# EasyEDA Pro project SchadenDeck.eprj, schematic MainBoard

## Sheets
1 Power, USB, & MCU: Board Name: MainBoard; Create Date: 2026-01-08; Page Name: Power, USB, & MCU; Project Name: SchadenDeck; Schematic Name: MainBoard; Update Date: 2026-02-11; Company: EasyEDA.com; Page Size: A4; Version: V1.0
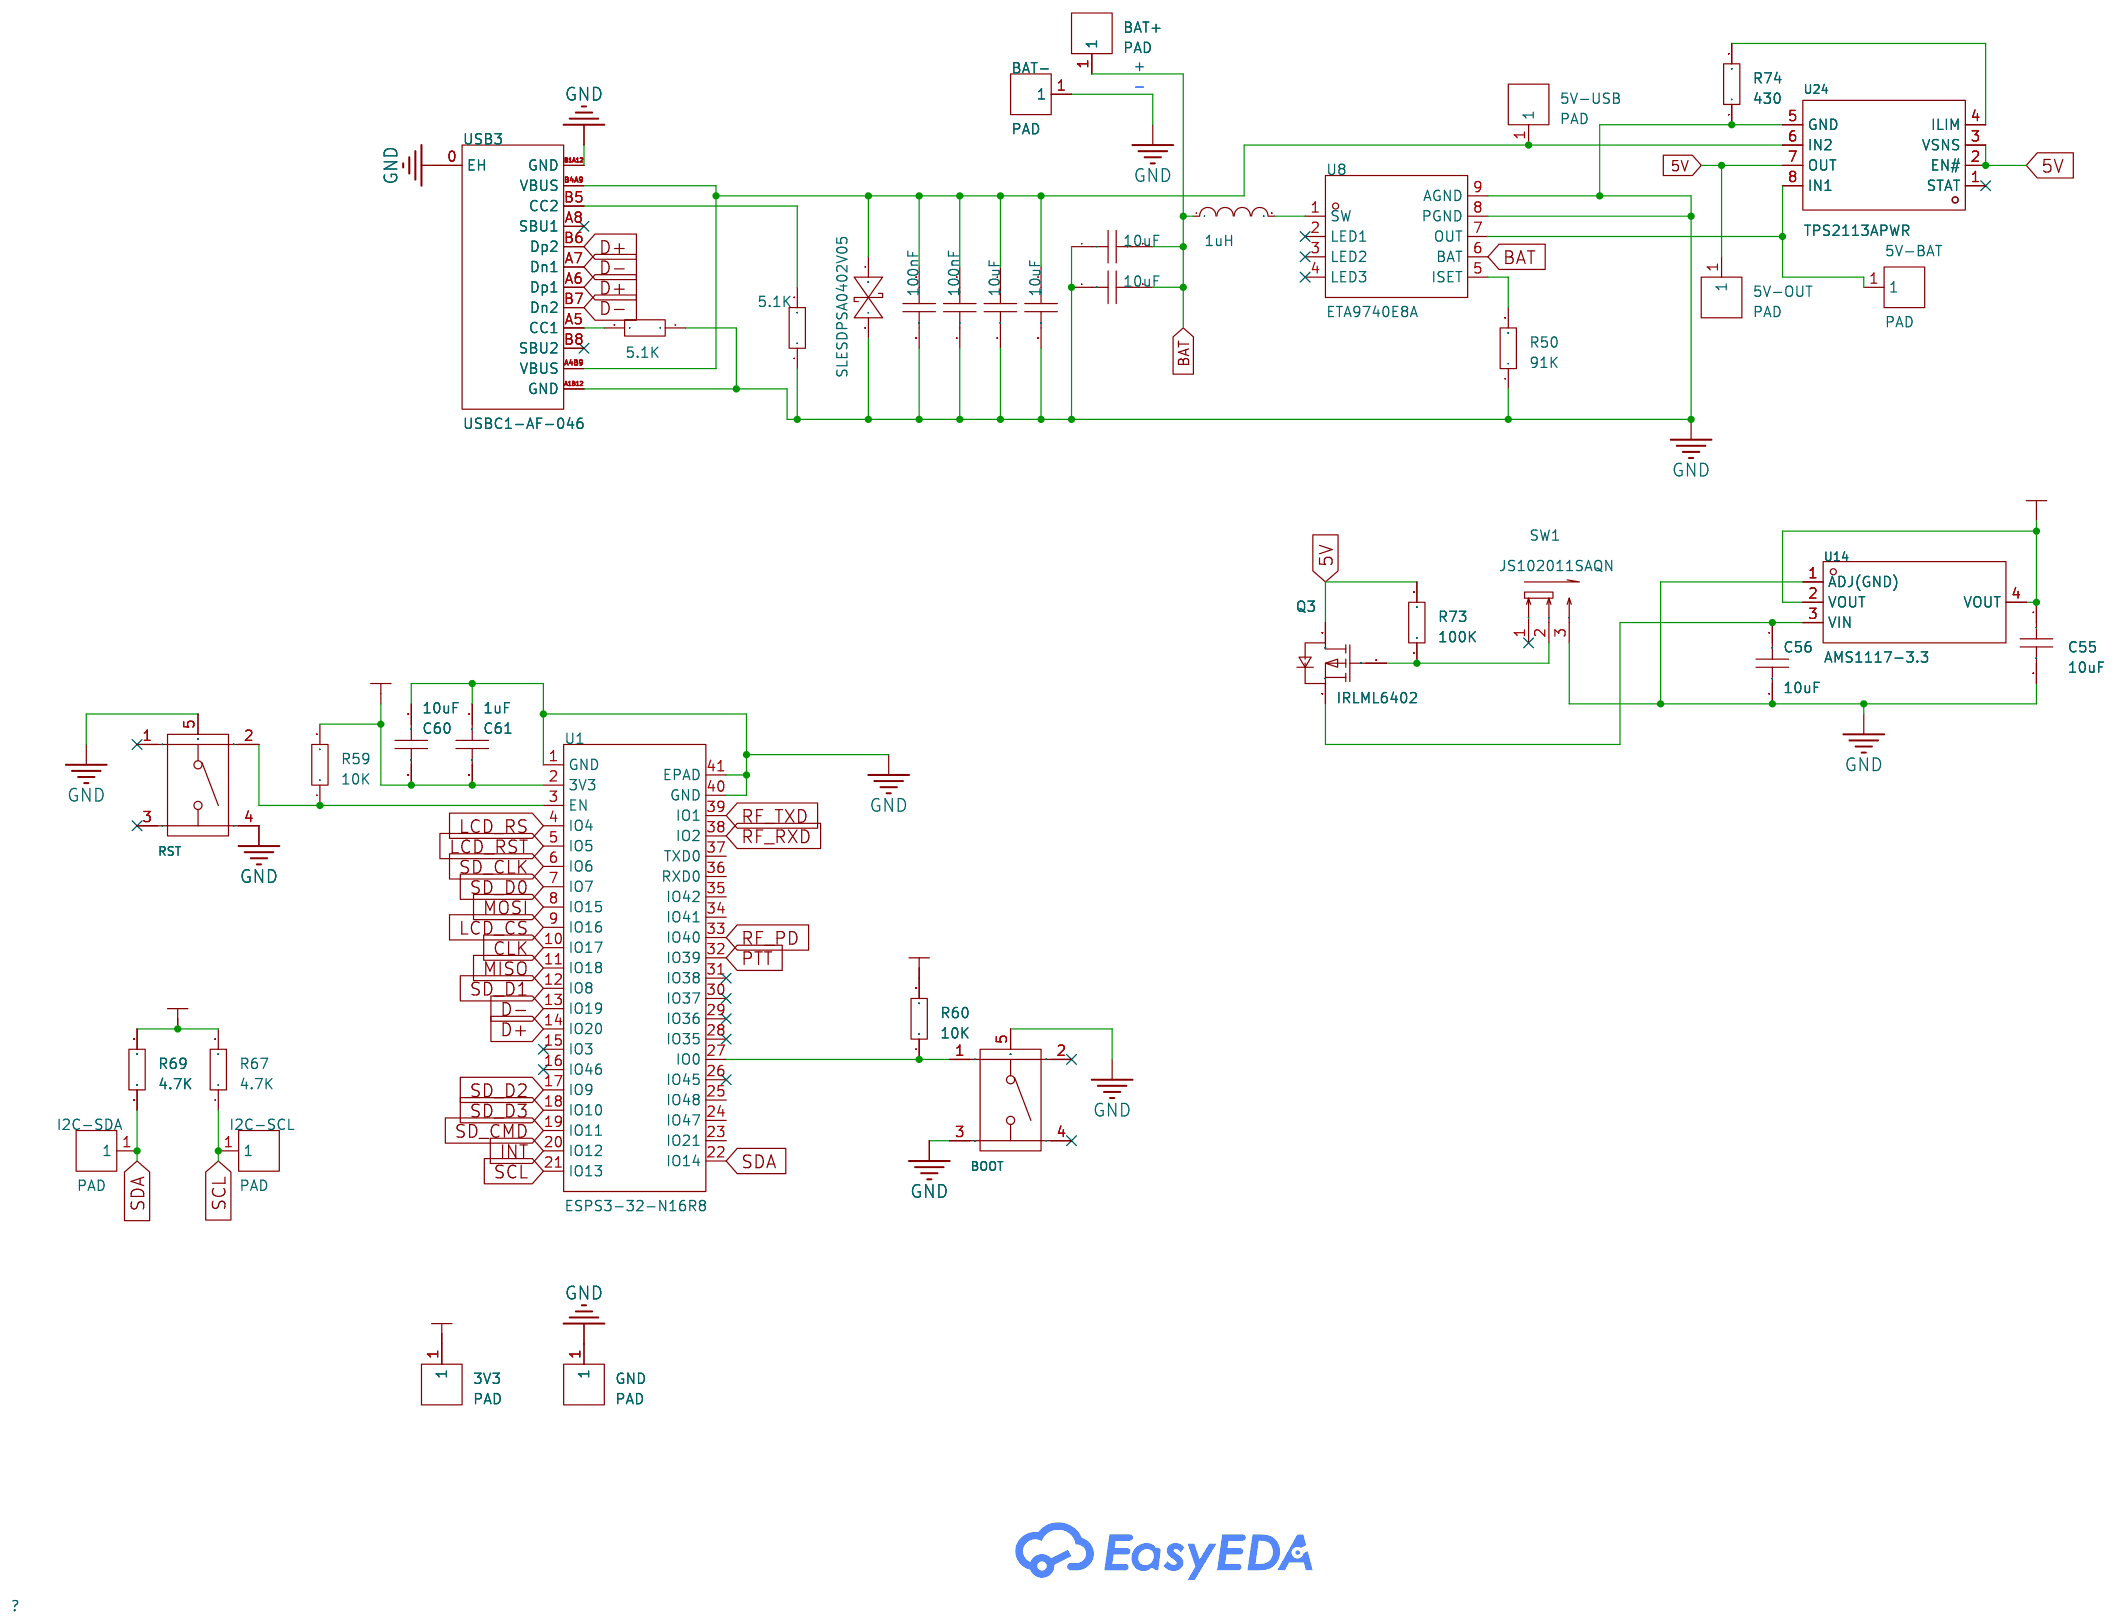
[diagram p0: Power, USB, & MCU]
2 Keyboard: Page Name: Keyboard; Update Date: 2026-01-18
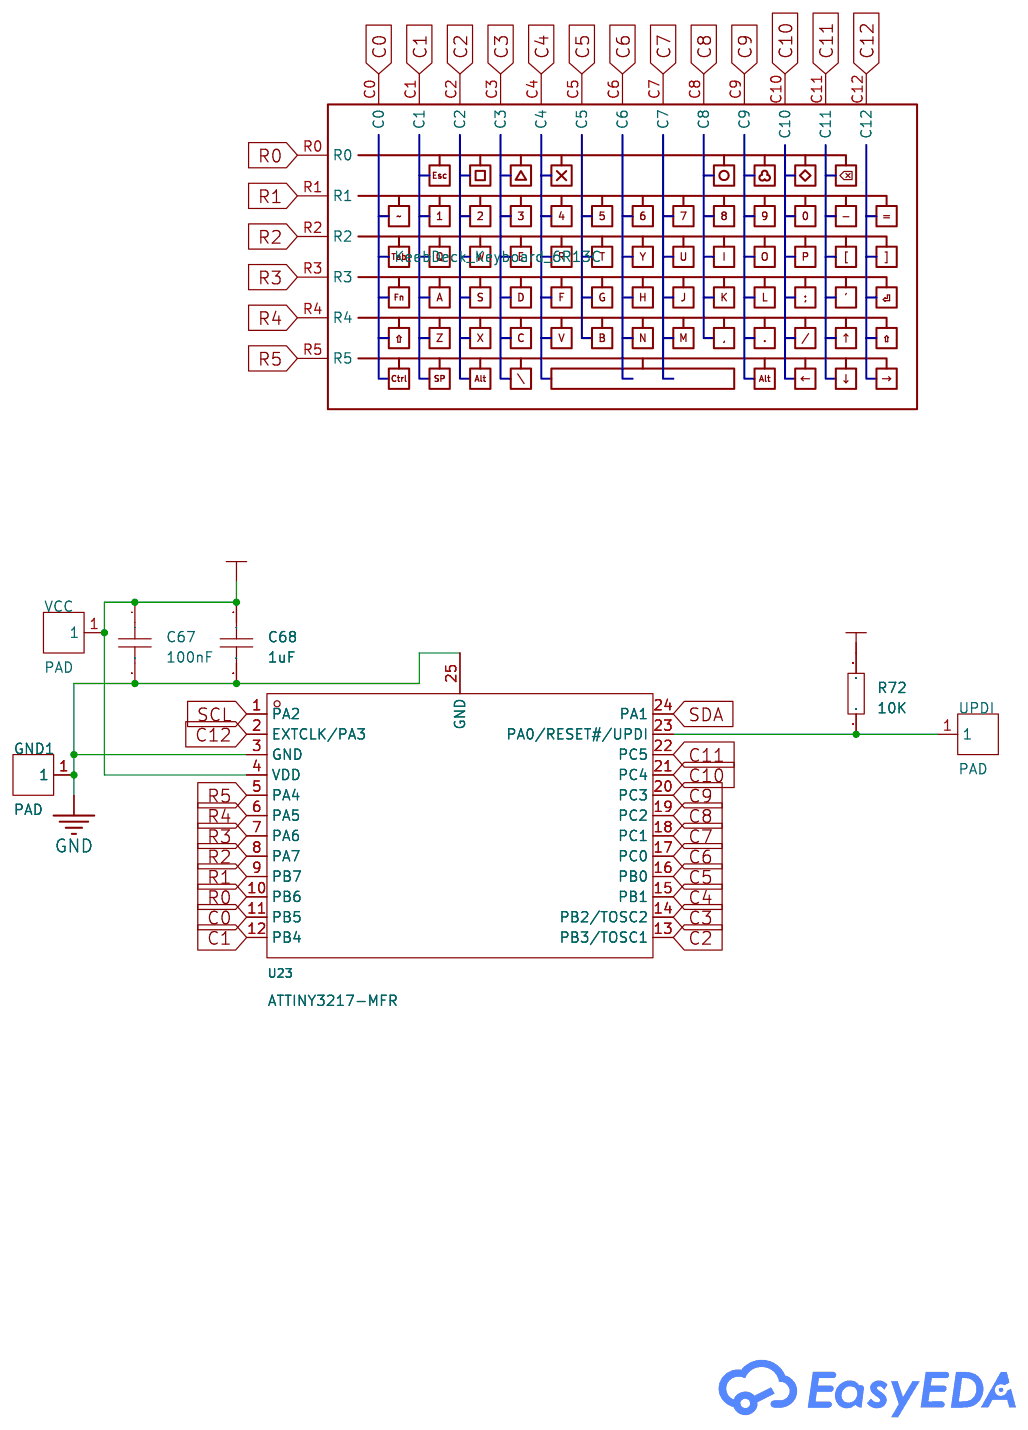
[diagram p1: Keyboard]
3 Storage & LCD: Page Name: Storage & LCD; Update Date: 2026-01-11
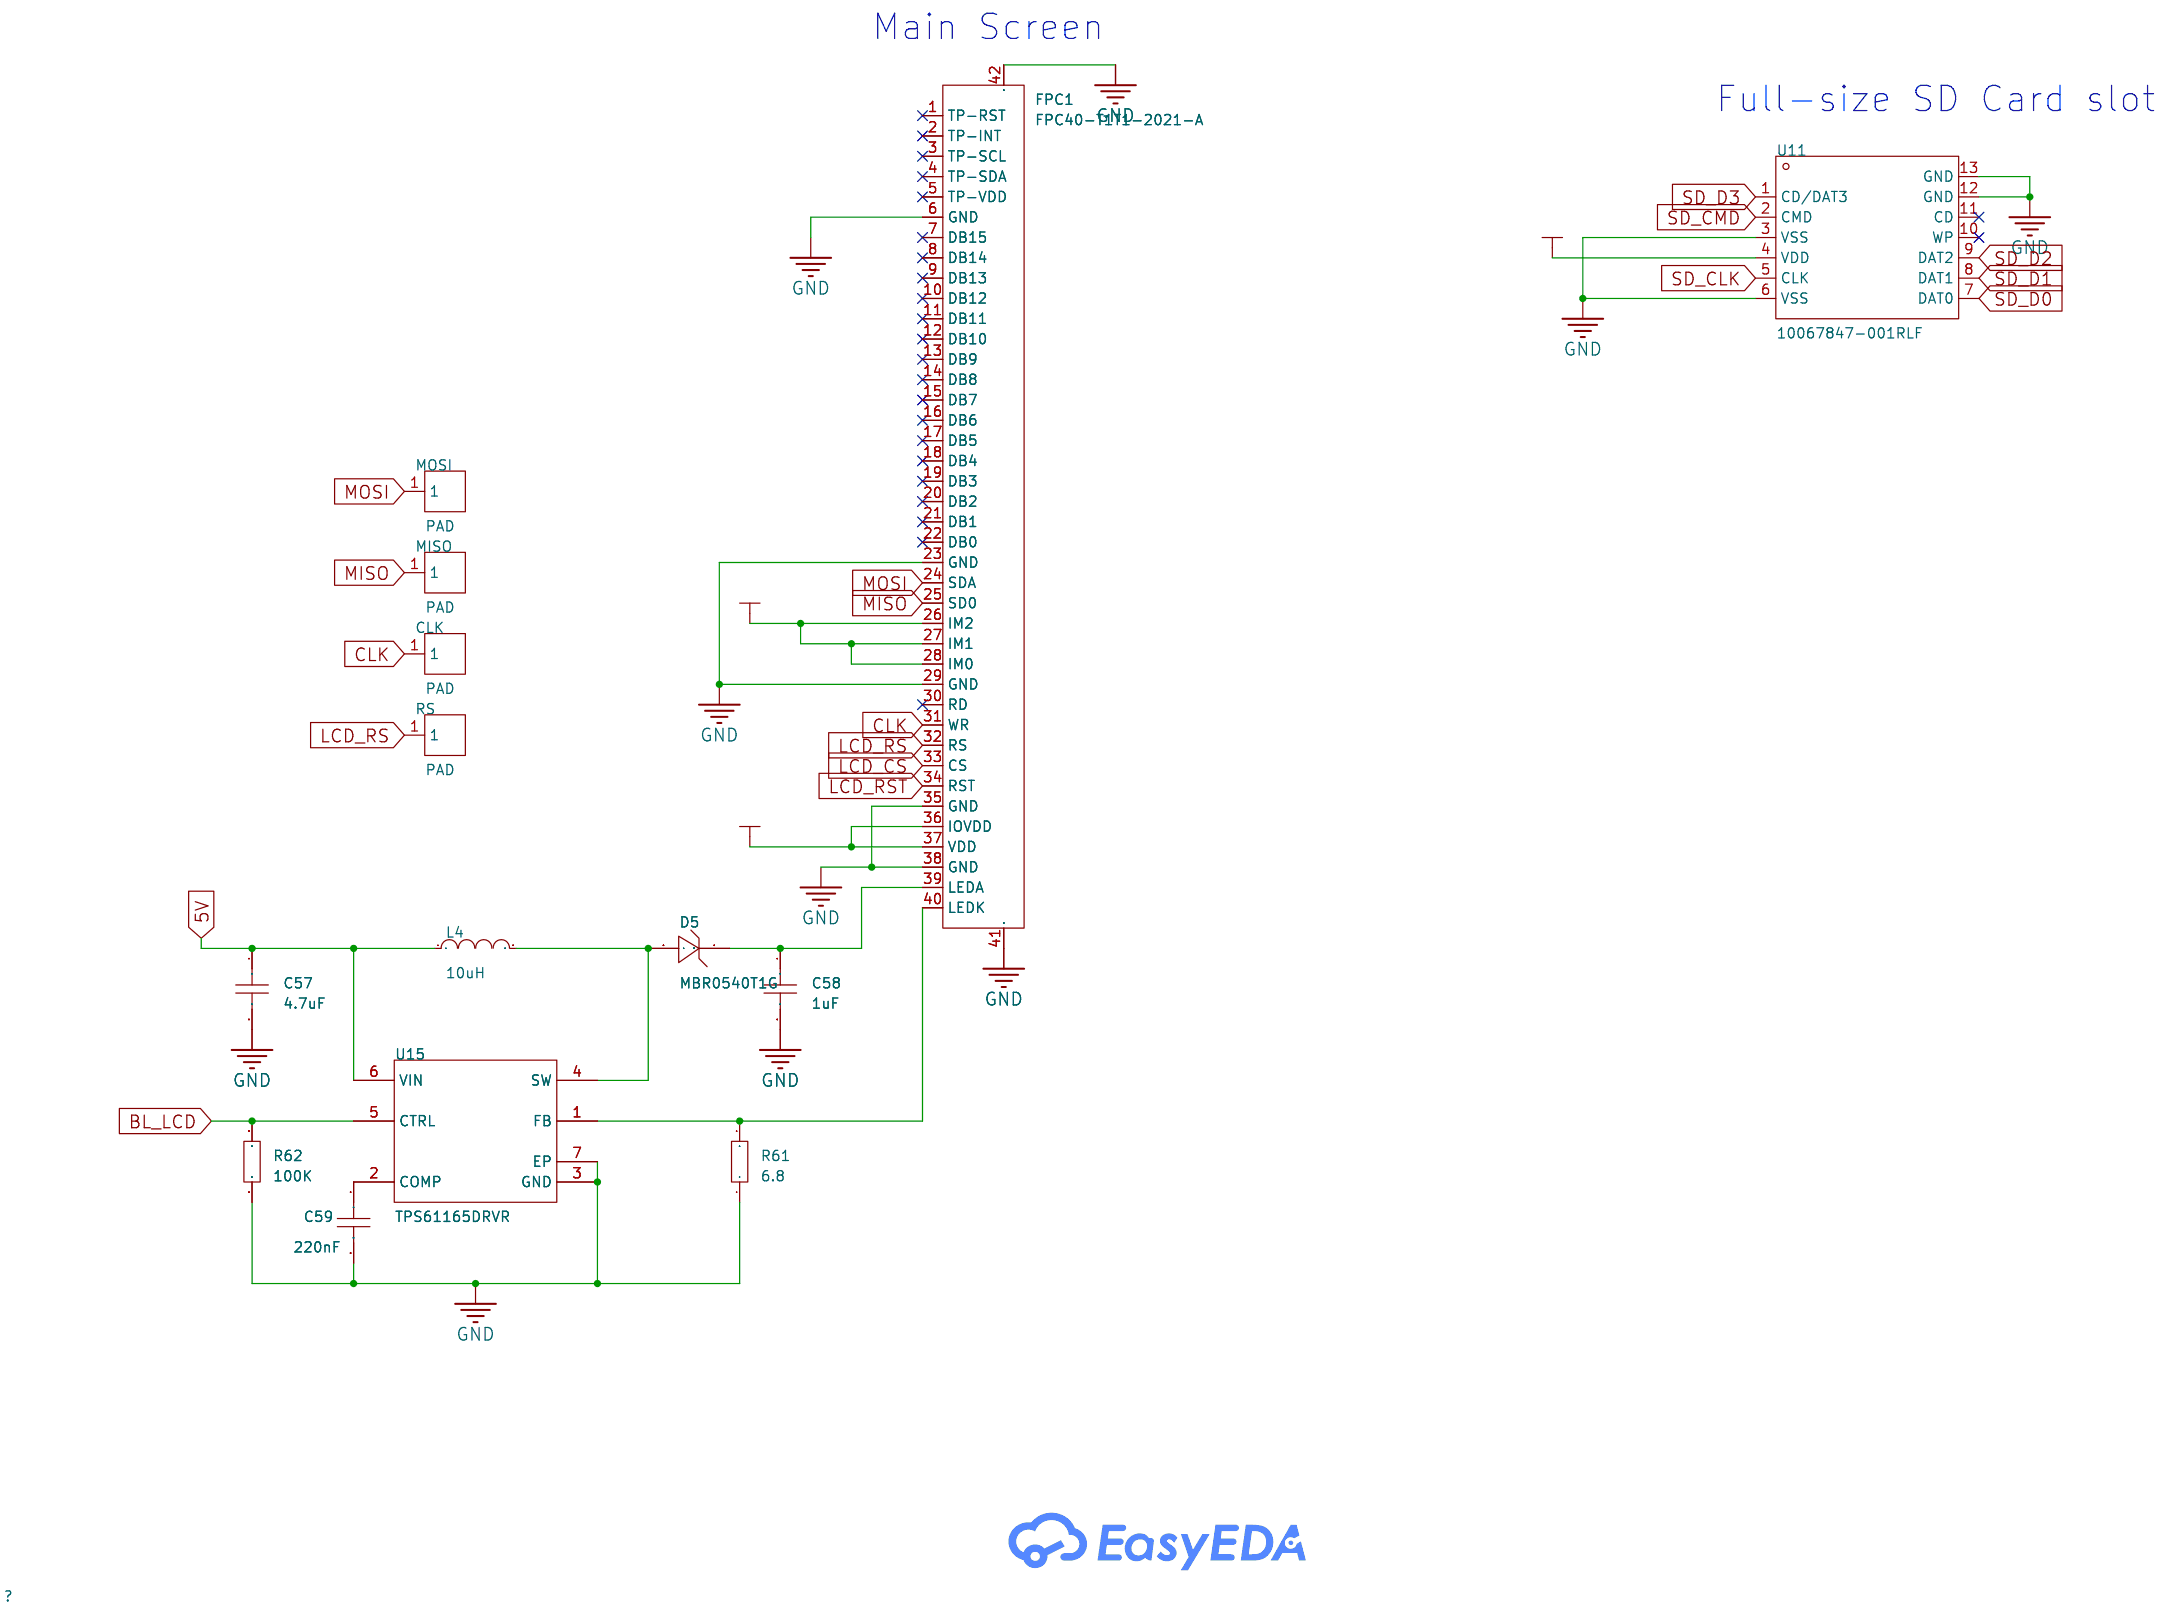
[diagram p2: Storage & LCD]
4 Audio & RF: Page Name: Audio & RF; Update Date: 2026-01-18
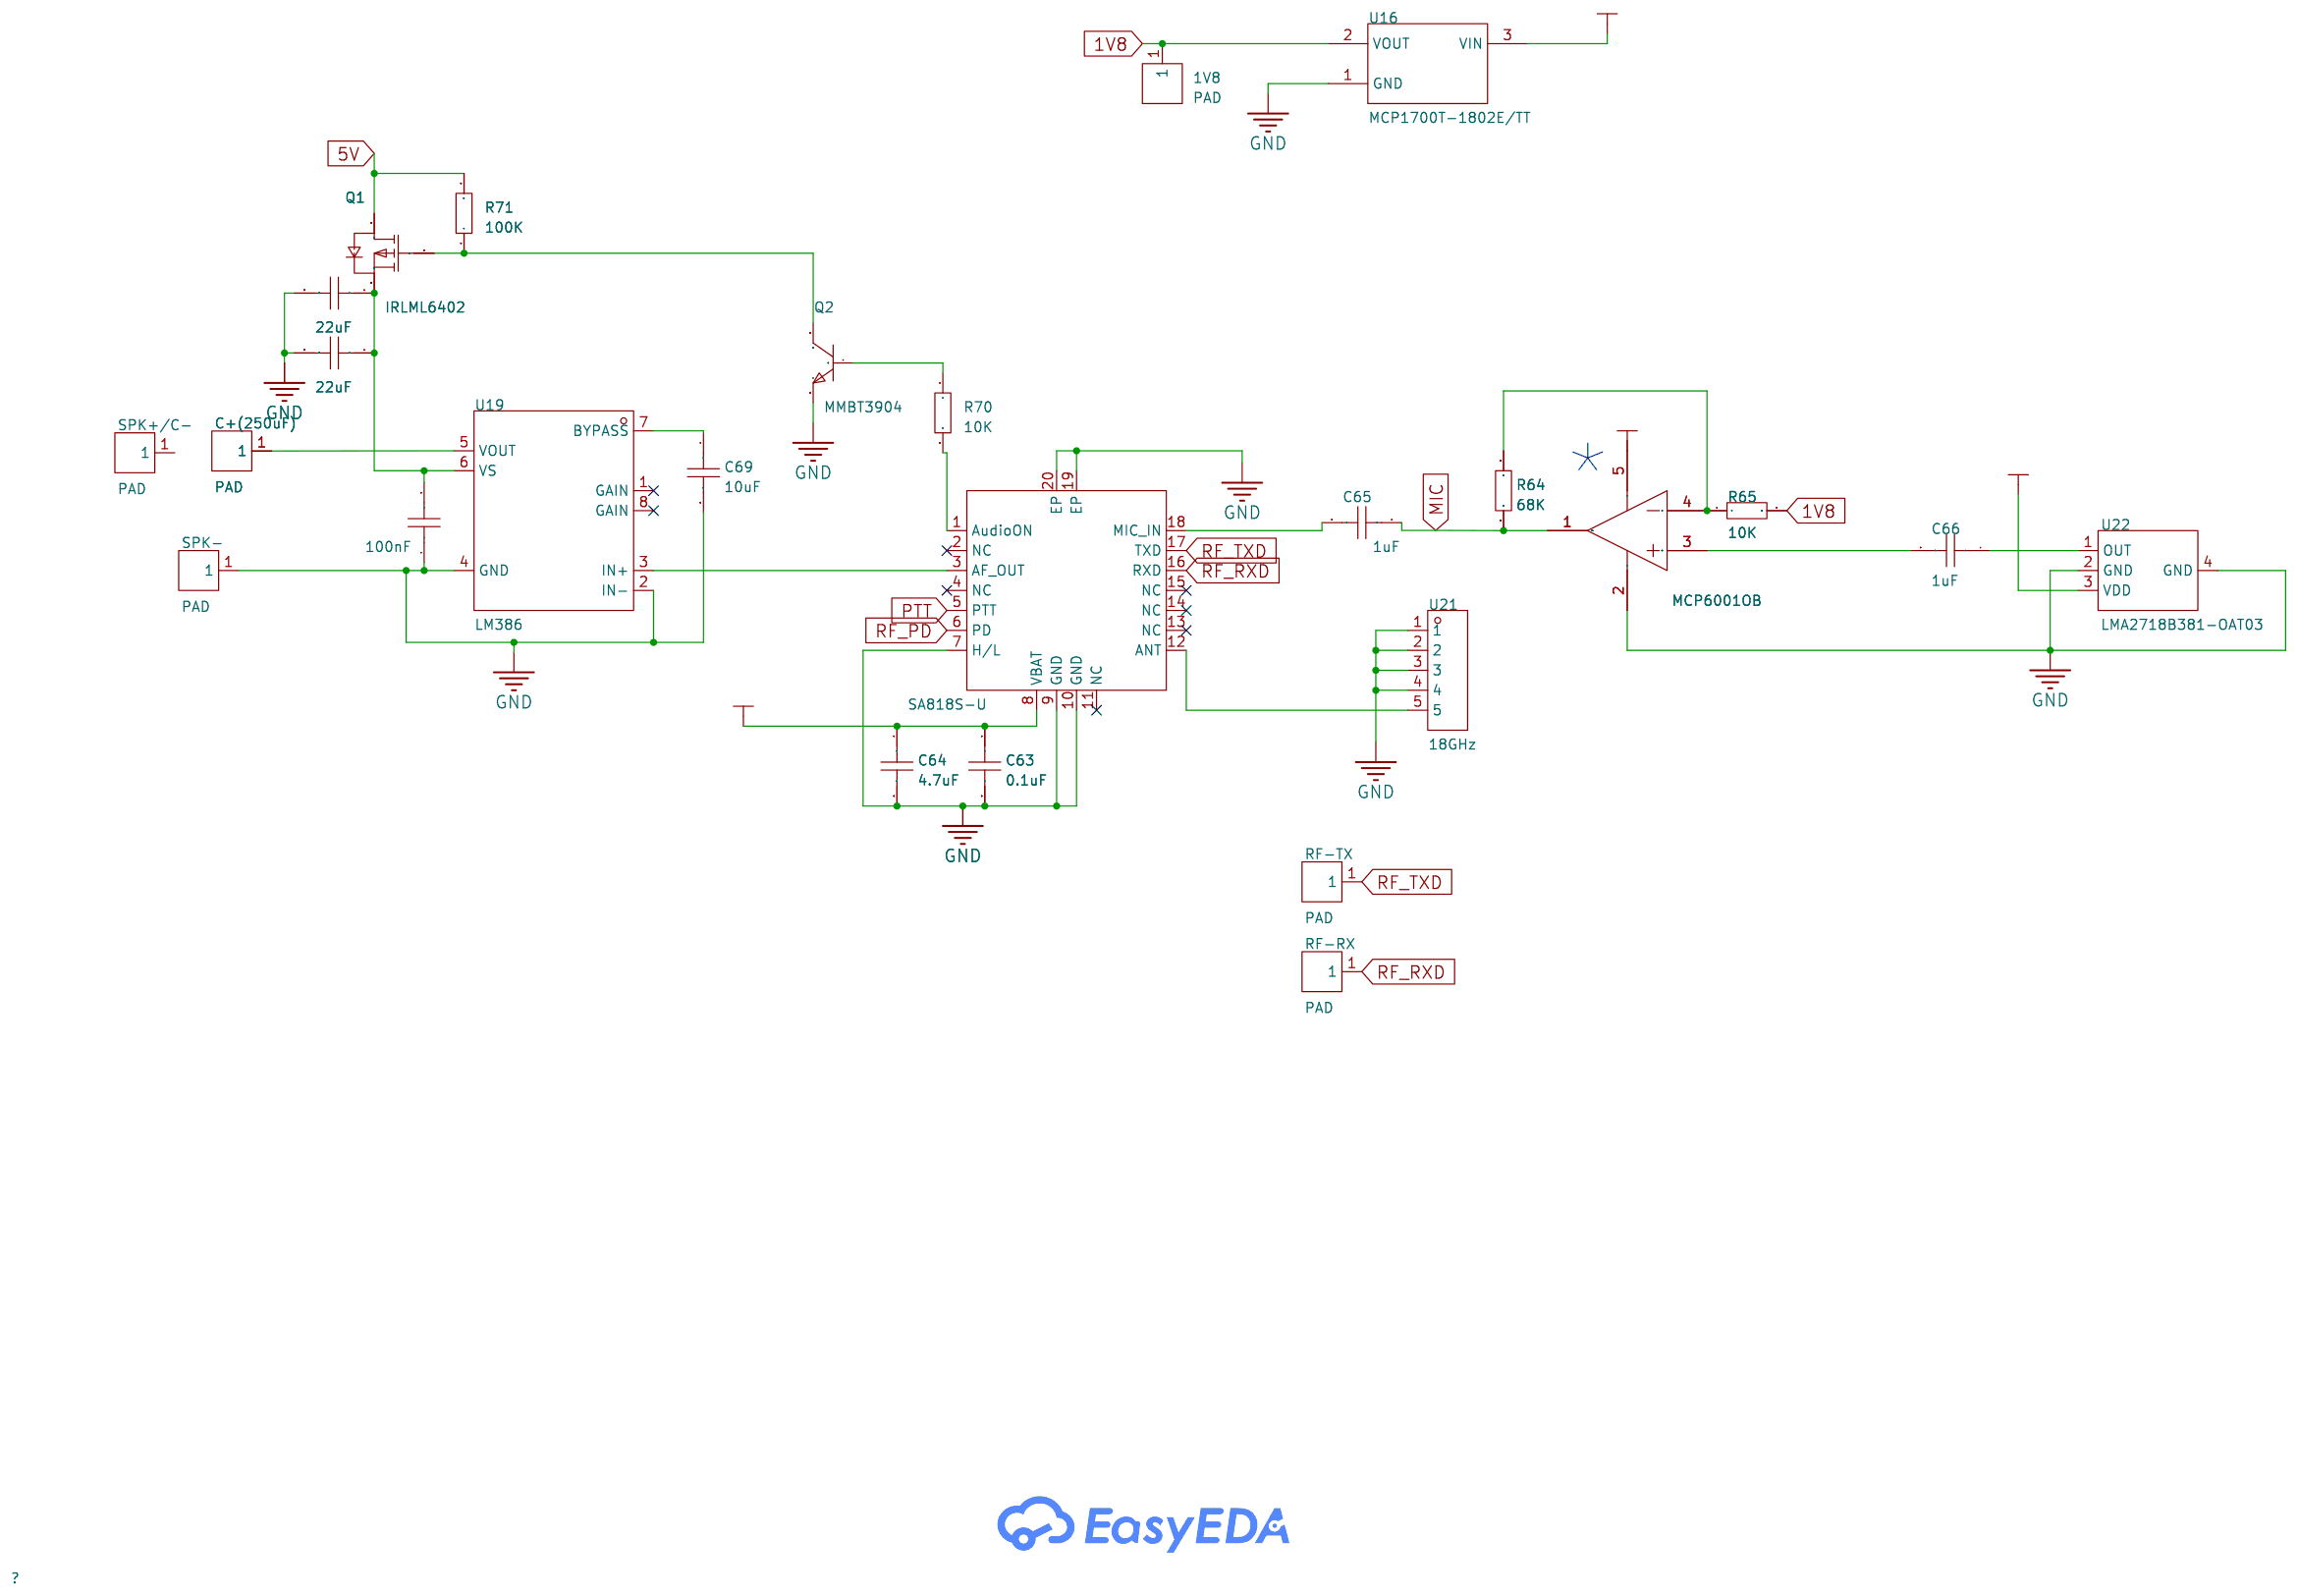
[diagram p3: Audio & RF]

## Parts
sheet Audio & RF
1V8  PAD  [SMD_BD4.0-L4.0-W4.0-D1.0]  (no BOM)
C63  0.1uF  [C0603]
C64  4.7uF  [C0603]
C65  1uF  [C0603]
C66  1uF  [C0603]
C69  10uF  [C0603]
C70  100nF  [C0603]
C71  22uF  [C0603]
C72  22uF  [C0603]
C+(250uF)  PAD  [SMD_BD4.0-L4.0-W4.0-D1.0]  (no BOM)
Q1  IRLML6402  [SOT-23-3_L2.9-W1.3-P0.95-LS2.4-BR]
Q2  MMBT3904  [SOT-23-3_L2.9-W1.3-P1.90-LS2.4-BR]
R64  68K  [R0603]
R65  10K  [R0603]
R70  10K  [R0603]
R71  100K  [R0603]
RF-RX  PAD  [SMD_BD4.0-L4.0-W4.0-D1.0]  (no BOM)
RF-TX  PAD  [SMD_BD4.0-L4.0-W4.0-D1.0]  (no BOM)
SPK+/C-  PAD  [SMD_BD4.0-L4.0-W4.0-D1.0]  (no BOM)
SPK-  PAD  [SMD_BD4.0-L4.0-W4.0-D1.0]  (no BOM)
U16  MCP1700T-1802E/TT  [SOT-23-3_L2.9-W1.3-P1.90-LS2.4-BR]
U17  MCP6001OB  [SOT-23-5_L3.0-W1.7-P0.95-LS2.8-BR]
U18  SA818S-U  [WIRELM-SMD_G-NICERF_SA818S-X]
U19  LM386  [SOP-8_L4.9-W3.9-P1.27-LS6.0-BL]
U21  18GHz  [CONN-TH_5P-L6.1-W6.1-P5.08-TL]
U22  LMA2718B381-OAT03  [MIC-SMD_4P-L2.8-W1.9_LMA2718B381-OA7]
sheet Keyboard
C67  100nF  [C0603]
C68  1uF  [C0603]
GND1  PAD  [SMD_BD4.0-L4.0-W4.0-D1.0]  (no BOM)
R72  10K  [R0603]
U2  KeebDeck_Keyboard_6R13C  [KeebDeck_Keyboard_6R13C]
U23  ATTINY3217-MFR  [WQFN-24_L4.0-W4.0-P0.50-TL-EP2.6]
UPDI  PAD  [SMD_BD4.0-L4.0-W4.0-D1.0]  (no BOM)
VCC  PAD  [SMD_BD4.0-L4.0-W4.0-D1.0]  (no BOM)
sheet Power, USB, & MCU
3V3  PAD  [SMD_BD4.0-L4.0-W4.0-D1.0]  (no BOM)
5V-BAT  PAD  [SMD_BD4.0-L4.0-W4.0-D1.0]  (no BOM)
5V-OUT  PAD  [SMD_BD4.0-L4.0-W4.0-D1.0]  (no BOM)
5V-USB  PAD  [SMD_BD4.0-L4.0-W4.0-D1.0]  (no BOM)
BAT+  PAD  [SMD_BD4.0-L4.0-W4.0-D1.0]  (no BOM)
BAT-  PAD  [SMD_BD4.0-L4.0-W4.0-D1.0]  (no BOM)
BOOT  KMR221GLFS  [KEY-SMD_KMR2XXGXXX]
C46  100nF  [C0603]
C47  100nF  [C0603]
C48  10uF  [C0603]
C49  10uF  [C0603]
C50  10uF  [C0603]
C51  10uF  [C0603]
C55  10uF  [C0603]
C56  10uF  [C0603]
C60  10uF  [C0603]
C61  1uF  [C0603]
D2  SLESDPSA0402V05  [D0402-BI]
GND  PAD  [SMD_BD4.0-L4.0-W4.0-D1.0]  (no BOM)
I2C-SCL  PAD  [SMD_BD4.0-L4.0-W4.0-D1.0]  (no BOM)
I2C-SDA  PAD  [SMD_BD4.0-L4.0-W4.0-D1.0]  (no BOM)
L3  1uH  [L0603]
Q3  IRLML6402  [SOT-23-3_L2.9-W1.3-P0.95-LS2.4-BR]
R50  91K  [R0603]
R51  5.1K  [R0603]
R52  5.1K  [R0603]
R59  10K  [R0603]
R60  10K  [R0603]
R67  4.7K  [R0603]
R69  4.7K  [R0603]
R73  100K  [R0603]
R74  430  [R0603]
RST  KMR221GLFS  [KEY-SMD_KMR2XXGXXX]
SW1  JS102011SAQN  [SW-SMD_JS102011SAQN]
U1  ESPS3-32-N16R8  [WIRELM-SMD_ESP32-S3-WROOM-1]
U8  ETA9740E8A  [ESOP-8_L4.9-W3.9-P1.27-LS6.0-BL-EP-1]
U14  AMS1117-3.3  [SOT-223-3_L6.5-W3.4-P2.30-LS7.0-BR]
U24  TPS2113APWR  [TSSOP-8_L4.4-W3.0-P0.65-LS6.4-BL]
USB3  USBC1-AF-046  [USB-C-SMD_USBC1-AF-046]
sheet Storage & LCD
C57  4.7uF  [C0603]
C58  1uF  [C0603]
C59  220nF  [C0603]
CLK  PAD  [SMD_BD4.0-L4.0-W4.0-D1.0]  (no BOM)
D5  MBR0540T1G  [SOD-123_L2.7-W1.6-LS3.7-RD]
FPC1  FPC40-T1T1-2021-A  [FPC-SMD_FPC40-T1T1-2021-A]
L4  10uH  [L0603]
MISO  PAD  [SMD_BD4.0-L4.0-W4.0-D1.0]  (no BOM)
MOSI  PAD  [SMD_BD4.0-L4.0-W4.0-D1.0]  (no BOM)
R61  6.8  [R0603]
R62  100K  [R0603]
RS  PAD  [SMD_BD4.0-L4.0-W4.0-D1.0]  (no BOM)
U11  10067847-001RLF  [SD-SMD_10067847-001RLF]
U15  TPS61165DRVR  [WSON-6_L2.0-W2.0-P0.65-TL-EP]

## Library data of the parts
1V8 3V3 5V-BAT 5V-OUT 5V-USB BAT+ BAT- C+(250uF) CLK GND GND1 I2C-SCL I2C-SDA MISO MOSI RF-RX RF-TX RS SPK+/C- SPK- UPDI VCC = PAD: Supplier Part: C9900017271; JLCPCB Part Class: Extended Part; Supplier: LCSC
C57-C59 C63-C66 = CAP_0603: Supplier Footprint: 0603; Supplier Part: C19702
C46-C51 C55 C56 C60 C61 C67-C72 = CAP_0603: Supplier Footprint: 0603
Q1 Q3 = IRLML6402_C5155451: LCSC Part Name: 1个P沟道 耐压:20V 电流:3.7A; Supplier Part: C5155451; Manufacturer: Slkor(萨科微); Supplier Footprint: SOT-23; JLCPCB Part Class: Extended Part; Datasheet: https://item.szlcsc.com/datasheet/IRLML6402/5785126.html; Supplier: LCSC; Number: 1 P-Channel; Drain to Source Voltage: 20V; Current - Continuous Drain(Id): 3.7A; RDS(on): 135mΩ@2.5V,3A; Pd - Power Dissipation: 1.4W; Gate Threshold Voltage (Vgs(th)): 1.2V; Gate Charge(Qg): 8nC@4.5V; Input Capacitance(Ciss): 633pF@10V; Reverse Transfer Capacitance (Crss@Vds): 110pF@10V; Operating Temperature: -55℃~+150℃
Q2 = MMBT3904_C51625775: Supplier Part: C51625775; Manufacturer: luJing(鲁晶); Supplier Footprint: SOT-23; JLCPCB Part Class: Extended Part; Datasheet: https://item.szlcsc.com/datasheet/MMBT3904/54282506.html; Supplier: LCSC
R61 R62 R64 R65 = Res_0603: Supplier Footprint: 0603; Supplier Part: C23186
R50-R52 R59 R60 R67 R69-R74 = Res_0603: Supplier Footprint: 0603
U16 = MCP1700T-1802E/TT: Output Type:Fixed Voltage - Supply:6V Output Voltage:1.8V Output Voltage:1.8V Output Current:200mA Power Supply Rejection Ratio (PSRR):44dB@(100Hz) Voltage Dropout:150mV@(200mA) standby current:1.6uA Features:Over Current Protection；Short Circuit Protecti; LCSC Part Name: 输入6V 输出1.8V~1.8V 200mA; Supplier Part: C150796; Manufacturer: MICROCHIP(美国微芯); Supplier Footprint: SOT-23; JLCPCB Part Class: Extended Part; Datasheet: https://item.szlcsc.com/datasheet/MCP1700T-1802E%252FTT/162136.html; Supplier: LCSC; Output Type: Fixed; Voltage - Supply: 6V; Output Voltage: 1.8V; Output Current: 200mA; Power Supply Rejection Ratio (PSRR): 44dB@(100Hz); Voltage Dropout: 150mV@(200mA); standby current: 1.6uA; Features: Over Current Protection；Short Circuit Protection；Over Temperature Protection; Operating Temperature: -40℃~+125℃@(Tj); Output Configuration: Positive; Number of Outputs: 1
U17 = MCP6001OB: Number of Channels:1 Maximum Power Supply Range (Vdd-Vss):7V Rail to Rail:- Gain Bandwidth Product:1MHz Vos - Input Offset Voltage:3.5mV Input Offset Voltage Drift(Vos TC):2.7uV/℃ Slew Rate:800V/ms Ib - Input Bias Current:1pA Input Offset Current(Ios):1pA; Supplier Part: C51026333; Manufacturer: GMIC(绿微); Supplier Footprint: SOT-23-5; JLCPCB Part Class: Extended Part; Datasheet: https://item.szlcsc.com/datasheet/MCP6001OB/53673011.html; Supplier: LCSC; Number of Channels: 1; Maximum Power Supply Range (Vdd-Vss): 7V; Gain Bandwidth Product: 1MHz; Vos - Input Offset Voltage: 3.5mV; Input Offset Voltage Drift(Vos TC): 2.7uV/℃; Slew Rate: 800V/ms; Ib - Input Bias Current: 1pA; Input Offset Current(Ios): 1pA; Noise density(eN): 27nV/√Hz@1kHz; Common Mode Rejection Ratio(CMRR): 70dB; Quiescent Current: 75uA; Output Current: 84mA; Operating Temperature: -40℃~+125℃; Single supply: 1.8V~6V
U18 = SA818S-U: LCSC Part Name: 对讲机模块; Supplier Part: C3001549; Manufacturer: G-NiceRF(思为无线); Supplier Footprint: SMD,19x35.6mm; JLCPCB Part Class: Extended Part; Datasheet: https://item.szlcsc.com/datasheet/SA818S-U/3484717.html; Supplier: LCSC
U19 = LM386_C22438596: Class:Class AB Speaker Channels:1-Channel Output Power:700mWx1@8Ω Voltage - Supply:4V~12V Voltage - Supply:4V~12V Total Harmonic Distortion + Noise (THD+N):0.2% Quiescent Current:4mA Operating Temperature:0℃~+70℃ Operating Temperature:0℃~+70℃; Supplier Part: C22438596; Manufacturer: PJSEMI(平晶微); Supplier Footprint: SOP-8; JLCPCB Part Class: Extended Part; Datasheet: https://item.szlcsc.com/datasheet/LM386/24077875.html; Supplier: LCSC; Class: Class AB; Speaker Channels: 1-Channel; Output Power: 700mWx1@8Ω; Voltage - Supply: 4V~12V; Total Harmonic Distortion + Noise (THD+N): 0.2%; Quiescent Current: 4mA; Operating Temperature: 0℃~+70℃
U21 = 733910070: Frequency:18GHz Impedance:50Ω Rated Voltage (Max):500V; Supplier Part: C588470; Manufacturer: MOLEX; Supplier Footprint: 插件; JLCPCB Part Class: Extended Part; Datasheet: https://www.molex.com/content/dam/molex/molex-dot-com/products/automated/en-us/salesdrawingpdf/733/73391/733910070_sd.pdf?inline; Supplier: LCSC; Impedance: 50Ω; Rated Voltage (Max): 500V
U22 = LMA2718B381-OAT03: Supplier Part: C47148420; Manufacturer: LinkMems(聆麦声学); Supplier Footprint: SMD-4P,2.8x1.7mm; JLCPCB Part Class: Extended Part; Datasheet: https://item.szlcsc.com/datasheet/LMA2718B381-OAT03/49348307.html; Supplier: LCSC
U2 = KeebDeck_Keyboard_6R13C
U23 = ATTINY3217-MFR: LCSC Part Name: tinyAVR 1系列汽车级微控制器; Supplier Part: C617969; Manufacturer: MICROCHIP(美国微芯); Supplier Footprint: WQFN-24-EP(4x4); JLCPCB Part Class: Extended Part; Datasheet: https://item.szlcsc.com/datasheet/ATTINY3217-MFR/647810.html; Supplier: LCSC; CPU Core: AVR; CPU Maximum Speed: 16MHz; Core Size: 8 Bit; Program Storage Size: 32KB; Program Memory Type: FLASH; RAM Size: 2KB; EEPROM: 256Byte; Number of I/O: 22; Oscillator Type: Built-in; Voltage - Supply: 2.7V~5.5V; Operating Temperature: -40℃~+125℃
BOOT RST = KMR221GLFS: Circuit:SPST Actuator Style:Round Button Operating Force:200gf Mounting Style:Brick nogging Switch Length:4.6mm Switch Width:2.8mm Switch Height:1.9mm Contact Current:50mA Voltage Rating (DC):32V With Lamp:- Pin Style:Gull Wing Mechanical Life:- Operating; LCSC Part Name: 4.6*2.8*1.9mm 立贴 轻触开关; Supplier Part: C72443; Manufacturer: C&K; Supplier Footprint: SMD; JLCPCB Part Class: Extended Part; Datasheet: https://atta.szlcsc.com/upload/public/pdf/source/20181012/C265019_000848423B8E84768868498C37CC451B.pdf; Supplier: LCSC; Circuit: SPST; Actuator Style: Round Button; Operating Force: 200gf; Mounting Style: Brick nogging; Switch Length: 4.6mm; Switch Width: 2.8mm; Switch Height: 1.9mm; Contact Current: 50mA; Voltage Rating (DC): 32V; Pin Style: Gull Wing; Operating Temperature: -40℃~+85℃
D2 = SLESDPSA0402V05: Polarity:Bidirectional Reverse Stand-Off Voltage (Vrwm):5V Clamping Voltage:40V Reverse Leakage Current (Ir):10nA Number of Channels:1 Operating Temperature:-55℃~+125℃ Operating Temperature:-55℃~+125℃ level of protection:IEC 61000-4-2 Type:ESD Junction Ca; LCSC Part Name: 双向ESD 5V截止; Supplier Part: C7496591; Manufacturer: Slkor(萨科微); Supplier Footprint: 0402; JLCPCB Part Class: Extended Part; Datasheet: https://item.szlcsc.com/datasheet/SLESDPSA0402V05/8561942.html; Supplier: LCSC; Polarity: Bidirectional; Reverse Stand-Off Voltage (Vrwm): 5V; Clamping Voltage: 40V; Reverse Leakage Current (Ir): 10nA; Number of Channels: 1; Operating Temperature: -55℃~+125℃; level of protection: IEC 61000-4-2; Type: ESD; Junction Capacitance: 0.05pF
L3 = L_0603
SW1 = JS102011SAQN: Circuit:SPDT Actuator Style:Rectangular Columnar Termination Style:SMD(SMT) Tab Switch Height:- Mounting Type:Surface Mount, Right Angle Current Rating:300mA Voltage Rating:6V Life:5,000 Cycles Operating Temperature:-40℃~+85℃ Operating Temperature:-40℃~+8; Supplier Part: C221660; Manufacturer: C&K; Supplier Footprint: SMD; JLCPCB Part Class: Extended Part; Datasheet: https://item.szlcsc.com/datasheet/JS102011SAQN/222090.html; Supplier: LCSC; Circuit: SPDT; Actuator Style: Rectangular Columnar; Termination Style: SMD(SMT) Tab; Mounting Type: Surface Mount, Right Angle; Current Rating: 300mA; Voltage Rating: 6V; Life: 5,000 Cycles; Operating Temperature: -40℃~+85℃
U1 = ESPS3-32-N16R8: LCSC Part Name: WiFi&Bluetooth模组,ESP32-S3R8芯片,128Mbit Flash,PCB天线; Supplier Part: C49164658; Manufacturer: DOIT(四博智联); Supplier Footprint: SMD,25.5x18mm; JLCPCB Part Class: Extended Part; Datasheet: https://item.szlcsc.com/datasheet/ESPS3-32-N16R8/51552682.html; Supplier: LCSC
U8 = ETA9740E8A: The Chip Type:Charging IC Voltage - Supply:4.5V~5.5V Voltage - Supply:4.5V~5.5V Charge Current - Max:3A Charging Saturation Voltage:4.21V End-Off Voltage:3.2V Type of Battery:Lithium-ion Number of Cells:1 Number of Cells:1 Operating Temperature:-40℃~+85℃; Supplier Part: C7465512; Manufacturer: ETA(钰泰); Supplier Footprint: ESOP8; JLCPCB Part Class: Extended Part; Datasheet: https://item.szlcsc.com/datasheet/ETA9740E8A/8507049.html; Supplier: LCSC; The Chip Type: Charging IC; Voltage - Supply: 4.5V~5.5V; Charge Current - Max: 3A; Charging Saturation Voltage: 4.21V; End-Off Voltage: 3.2V; Type of Battery: Lithium-ion; Number of Cells: 1; Operating Temperature: -40℃~+85℃
U14 = AMS1117-3.3_C2891839: Output Type:Fixed Voltage - Supply:18V Output Voltage:3.3V Output Voltage:3.3V Output Current:1A Power Supply Rejection Ratio (PSRR):60dB@(120Hz) Voltage Dropout:1.3V@(1A) standby current:10mA Noise:0.005%Vout Features:Over Current Protection；Over Tempera; LCSC Part Name: 输入18V 输出3.3V 1A; Supplier Part: C2891839; Manufacturer: YONGYUTAI(永裕泰); Supplier Footprint: SOT-223-3; JLCPCB Part Class: Extended Part; Datasheet: https://item.szlcsc.com/datasheet/AMS1117-3.3/3119758.html; Supplier: LCSC; Output Type: Fixed; Voltage - Supply: 18V; Output Voltage: 3.3V; Output Current: 1A; Power Supply Rejection Ratio (PSRR): 60dB@(120Hz); Voltage Dropout: 1.3V@(1A); standby current: 10mA; Noise: 0.005%Vout; Features: Over Current Protection；Over Temperature Protection; Operating Temperature: -40℃~+125℃@(Tj); Output Configuration: Positive; Number of Outputs: 1
U24 = TPS2113APWR: LCSC Part Name: 双输入单输出电源多路复用器; Supplier Part: C130052; Manufacturer: TI(德州仪器); Supplier Footprint: TSSOP-8; JLCPCB Part Class: Extended Part; Datasheet: https://www.ti.com/cn/lit/gpn/tps2113a; Supplier: LCSC; Type: Load Switch; Number of Channels: 1; Control Input Logic: Active High; Maximum Continuous Current: 2A; Voltage - Supply: 2.8V~5.5V; RDS(on): 84mΩ; Operating Temperature	-: -40℃~+85℃; Features: Over Temperature Protection
USB3 = USBC1-AF-046: Connector Type:Type-C Protocol Standard:USB 3.1 Gender:Female Mounting Type:Recessed Mount Number of Contacts:16P Number of Ports:1 Current Rating-Power:5A Connect-Disconnect Life:10,000 Cycles Length:6.5mm Detection color:Black Operating Temperature:-30℃; LCSC Part Name: Type-C 母 沉板; Supplier Part: C50305660; Manufacturer: CHIN-BAN(勤本); Supplier Footprint: SMD; JLCPCB Part Class: Extended Part; Datasheet: https://item.szlcsc.com/datasheet/USBC1-AF-046/52896317.html; Supplier: LCSC; Connector Type: Type-C; Protocol Standard: USB 3.1; Gender: Female; Mounting Type: Recessed Mount; Number of Contacts: 16P; Number of Ports: 1; Current Rating-Power: 5A; Connect-Disconnect Life: 10,000 Cycles; Length: 6.5mm; Detection color: Black; Operating Temperature: -30℃~+85℃
D5 = MBR0540T1G_C42385147: LCSC Part Name: 电压:40V 电流:500mA; Supplier Part: C42385147; Manufacturer: GOODWORK(固得沃克); Supplier Footprint: SOD-123; JLCPCB Part Class: Extended Part; Datasheet: https://item.szlcsc.com/datasheet/MBR0540T1G/44306266.html; Supplier: LCSC; Diode Configuration: Independent; Voltage - Forward(Vf@If): 620mV@1A; Voltage - DC Reverse(Vr): 40V; Current - Rectified: 500mA; Reverse Leakage Current (Ir): 10uA@20V; Operating Junction Temperature Range: -50℃~+150℃; Non-Repetitive Peak Forward Surge Current: 5.5A
FPC1 = FPC40-T1T1-2021-A: Locking Feature:Hinged Lid Contact Type:Bottom Contact Number of Contacts:40P Pitch:0.5mm Mounting Type:Surface Mount, Right Angle FFC, FCB Thickness:0.3mm FFC, FCB Thickness:0.3mm Height Above Board:1.5mm Contact Material:Copper Contact Plating:Tin Rated; LCSC Part Name: 翻盖式 下接 P数:40P 间距:0.5mm; Supplier Part: C52740868; Manufacturer: SHETIME(高钺达); Supplier Footprint: SMD,P=0.5mm,卧贴; JLCPCB Part Class: Extended Part; Datasheet: https://item.szlcsc.com/datasheet/FPC40-T1T1-2021-A/55627484.html; Supplier: LCSC; Locking Feature: Hinged Lid; Contact Type: Bottom Contact; Number of Contacts: 40P; Pitch: 0.5mm; Mounting Type: Surface Mount, Right Angle; FFC, FCB Thickness: 0.3mm; Height Above Board: 1.5mm; Contact Material: Copper; Contact Plating: Tin; Rated Voltage (Max): 50V
L4 = L_0603: Supplier Part: C963789
U11 = 10067847-001RLF: Card Connection Mode:Push-Push Card Type:Standard SD Card Connector Type:Connector and Ejector Additional Card Detection Pins:Yes Supplementary Features:- Height Above Board:2.8mm Operating Temperature:- Operating Temperature:-; LCSC Part Name: 自弹式 标准SD卡 卡座; Supplier Part: C569097; Manufacturer: Amphenol; Supplier Footprint: SMD; JLCPCB Part Class: Extended Part; Datasheet: https://item.szlcsc.com/datasheet/10067847-001RLF/594672.html; Supplier: LCSC; Card Connection Mode: Push-Push; Card Type: Standard SD Card; Connector Type: Connector and Ejector; Additional Card Detection Pins: Yes; Height Above Board: 2.8mm
U15 = TPS61165DRVR: Type:DC-DCVoltage Stabilizer Input Voltage:3V~18V Input Voltage:3V~18V Switch Frequency:1.2MHz Switch Frequency:1.2MHz Channels:1 Output Voltage:3V~38V Output Voltage:3V~38V Output Current:1.2A Dimming:PWM Topology:boost converter Operating temperature:-4; Supplier Part: C122568; Manufacturer: TI(德州仪器); Supplier Footprint: WSON-6-EP(2x2); JLCPCB Part Class: Extended Part; Datasheet: https://www.ti.com/cn/lit/gpn/tps61165; Supplier: LCSC; Type: DC-DCVoltage Stabilizer; Input Voltage: 3V~18V; Switch Frequency: 1.2MHz; Channels: 1; Output Voltage: 3V~38V; Output Current: 1.2A; Dimming: PWM; Topology: boost converter; Operating temperature: -40℃~+85℃

## Nets
1V8: 1V8.1 R65.2 U16.2(VOUT)
3V3: 3V3.1 C55.1 C60.2 C61.2 C63.1 C64.1 C67.1 C68.1 FPC1.26(IM2) FPC1.27(IM1) FPC1.28(IM0) FPC1.36(IOVDD) FPC1.37(VDD) R59.2 R60.2 R67.2 R69.2 R72.2 U1.2(3V3) U11.4(VDD) U14.2(VOUT) U14.4(VOUT) U16.3(VIN) U17.5(V+) U18.8(VBAT) U22.3(VDD) U23.4(VDD) VCC.1
5V: 5V-OUT.1 C57.1 L4.1 Q1.3(D) Q3.3(D) R71.2 R73.2 U15.6(VIN) U24.2(EN#) U24.3(VSNS) U24.7(OUT)
GND: BAT-.1 BOOT.3 BOOT.5 C46.2 C47.2 C48.2 C49.2 C50.1 C51.1 C55.2 C56.2 C57.2 C58.2 C59.2 C60.1 C61.1 C63.2 C64.2 C67.2 C68.2 C69.2 C70.1 C71.2 C72.2 D2.2(A) FPC1.6(GND) FPC1.23(GND) FPC1.29(GND) FPC1.35(GND) FPC1.38(GND) FPC1.41 FPC1.42 GND.1 GND1.1 Q2.2(E) R50.1 R51.1 R52.1 R61.1 R62.1 R74.1 RST.4 RST.5 SPK-.1 SW1.3 U1.1(GND) U1.40(GND) U1.41(EPAD) U8.8(PGND) U8.9(AGND) U11.3(VSS) U11.6(VSS) U11.12(GND) U11.13(GND) U14.1(ADJ(GND)) U15.3(GND) U15.7(EP) U16.1(GND) U17.2(V-) U18.7(H/L) U18.9(GND) U18.10(GND) U18.19(EP) U18.20(EP) U19.2(IN-) U19.4(GND) U21.1 U21.2 U21.3 U21.4 U22.2(GND) U22.4(GND) U23.3(GND) U23.25(GND) U24.5(GND) USB3.0(EH) USB3.A1B12(GND) USB3.B1A12(GND)
BAT: BAT+.1 C50.2 C51.2 L3.1 U8.6(BAT)
BL_LCD: R62.2 U15.5(CTRL)
C0: U2.C0 U23.11(PB5)
C1: U2.C1 U23.12(PB4)
C2: U2.C2 U23.13(PB3/TOSC1)
C3: U2.C3 U23.14(PB2/TOSC2)
C4: U2.C4 U23.15(PB1)
C5: U2.C5 U23.16(PB0)
C6: U2.C6 U23.17(PC0)
C7: U2.C7 U23.18(PC1)
C8: U2.C8 U23.19(PC2)
C9: U2.C9 U23.20(PC3)
C10: U2.C10 U23.21(PC4)
C11: U2.C11 U23.22(PC5)
C12: U2.C12 U23.2(EXTCLK/PA3)
CLK: CLK.1 FPC1.31(WR) U1.10(IO17)
D+: U1.14(IO20) USB3.A6(Dp1) USB3.B6(Dp2)
D-: U1.13(IO19) USB3.A7(Dn1) USB3.B7(Dn2)
INT: U1.20(IO12)
LCD_CS: FPC1.33(CS) U1.9(IO16)
LCD_RS: FPC1.32(RS) RS.1 U1.4(IO4)
LCD_RST: FPC1.34(RST) U1.5(IO5)
MIC: C65.1 R64.1 U17.1(OUT)
MISO: FPC1.25(SD0) MISO.1 U1.11(IO18)
MOSI: FPC1.24(SDA) MOSI.1 U1.8(IO15)
PTT: U1.32(IO39) U18.5(PTT)
R0: U2.R0 U23.10(PB6)
R1: U2.R1 U23.9(PB7)
R2: U2.R2 U23.8(PA7)
R3: U2.R3 U23.7(PA6)
R4: U2.R4 U23.6(PA5)
R5: U2.R5 U23.5(PA4)
RF_PD: U1.33(IO40) U18.6(PD)
RF_RXD: RF-RX.1 U1.38(IO2) U18.16(RXD)
RF_TXD: RF-TX.1 U1.39(IO1) U18.17(TXD)
SCL: I2C-SCL.1 R67.1 U1.21(IO13) U23.1(PA2)
SD_CLK: U1.6(IO6) U11.5(CLK)
SD_CMD: U1.19(IO11) U11.2(CMD)
SD_D0: U1.7(IO7) U11.7(DAT0)
SD_D1: U1.12(IO8) U11.8(DAT1)
SD_D2: U1.17(IO9) U11.9(DAT2)
SD_D3: U1.18(IO10) U11.1(CD/DAT3)
SDA: I2C-SDA.1 R69.1 U1.22(IO14) U23.24(PA1)
$1N2501: BOOT.1 R60.1 U1.27(IO0)
$1N2530: R59.1 RST.2 U1.3(EN)
$1N4339: R52.2 USB3.B5(CC2)
$1N4352: R50.2 U8.5(ISET)
$1N4388: L3.2 U8.1(SW)
$1N6687: R51.2 USB3.A5(CC1)
$1N9353: C56.1 Q3.2(S) U14.3(VIN)
$1N12779: Q3.1(G) R73.1 SW1.2
$1N13089: 5V-BAT.1 U8.7(OUT) U24.8(IN1)
$1N13109: 5V-USB.1 C46.1 C47.1 C48.1 C49.1 D2.1(C) U24.6(IN2) USB3.A4B9(VBUS) USB3.B4A9(VBUS)
$1N13229: R74.2 U24.4(ILIM)
$6N6275: R72.1 U23.23(PA0/RESET#/UPDI) UPDI.1
$7N1968: D5.2(A) L4.2 U15.4(SW)
$7N2138: C58.1 D5.1(C) FPC1.39(LEDA)
$7N2168: FPC1.40(LEDK) R61.2 U15.1(FB)
$7N2271: C59.1 U15.2(COMP)
$8N1477: U18.3(AF_OUT) U19.3(IN+)
$8N1633: C+(250uF).1 U19.5(VOUT)
$8N2011: U18.12(ANT) U21.5
$8N2442: R64.2 R65.1 U17.4(-IN)
$8N2615: C66.2 U17.3(+IN)
$8N2619: C66.1 U22.1(OUT)
$8N2632: C65.2 U18.18(MIC_IN)
$8N3977: C70.2 C71.1 C72.1 Q1.2(S) U19.6(VS)
$8N4519: Q2.1(B) R70.1
$8N4602: R70.2 U18.1(AudioON)
$8N4635: Q1.1(G) Q2.3(C) R71.1
$8N4810: C69.1 U19.7(BYPASS)

Not connected (* = marked no-connect by the designer): BOOT 2* 4*; FPC1 1(TP-RST)* 2(TP-INT)* 3(TP-SCL)* 4(TP-SDA)* 5(TP-VDD)* 7(DB15)* 8(DB14)* 9(DB13)* 10(DB12)* 11(DB11)* 12(DB10)* 13(DB9)* 14(DB8)* 15(DB7)* 16(DB6)* 17(DB5)* 18(DB4)* 19(DB3)* 20(DB2)* 21(DB1)* 22(DB0)* 30(RD)*; RST 1* 3*; SPK+/C- 1; SW1 1*; U1 15(IO3)* 16(IO46)* 23(IO21) 24(IO47) 25(IO48) 26(IO45)* 28(IO35)* 29(IO36)* 30(IO37)* 31(IO38)* 34(IO41) 35(IO42) 36(RXD0) 37(TXD0); U8 2(LED1)* 3(LED2)* 4(LED3)*; U11 10(WP)* 11(CD)*; U18 2(NC)* 4(NC)* 11(NC)* 13(NC)* 14(NC)* 15(NC)*; U19 1(GAIN)* 8(GAIN)*; U24 1(STAT)*; USB3 A8(SBU1)* B8(SBU2)*

## Notes on the sheets
sheet 1
- +
- -
sheet 3
- Main Screen
- Full-size SD Card slot
sheet 4
- *
